# Altium schematic sheet CAN Communication.SchDoc
size A
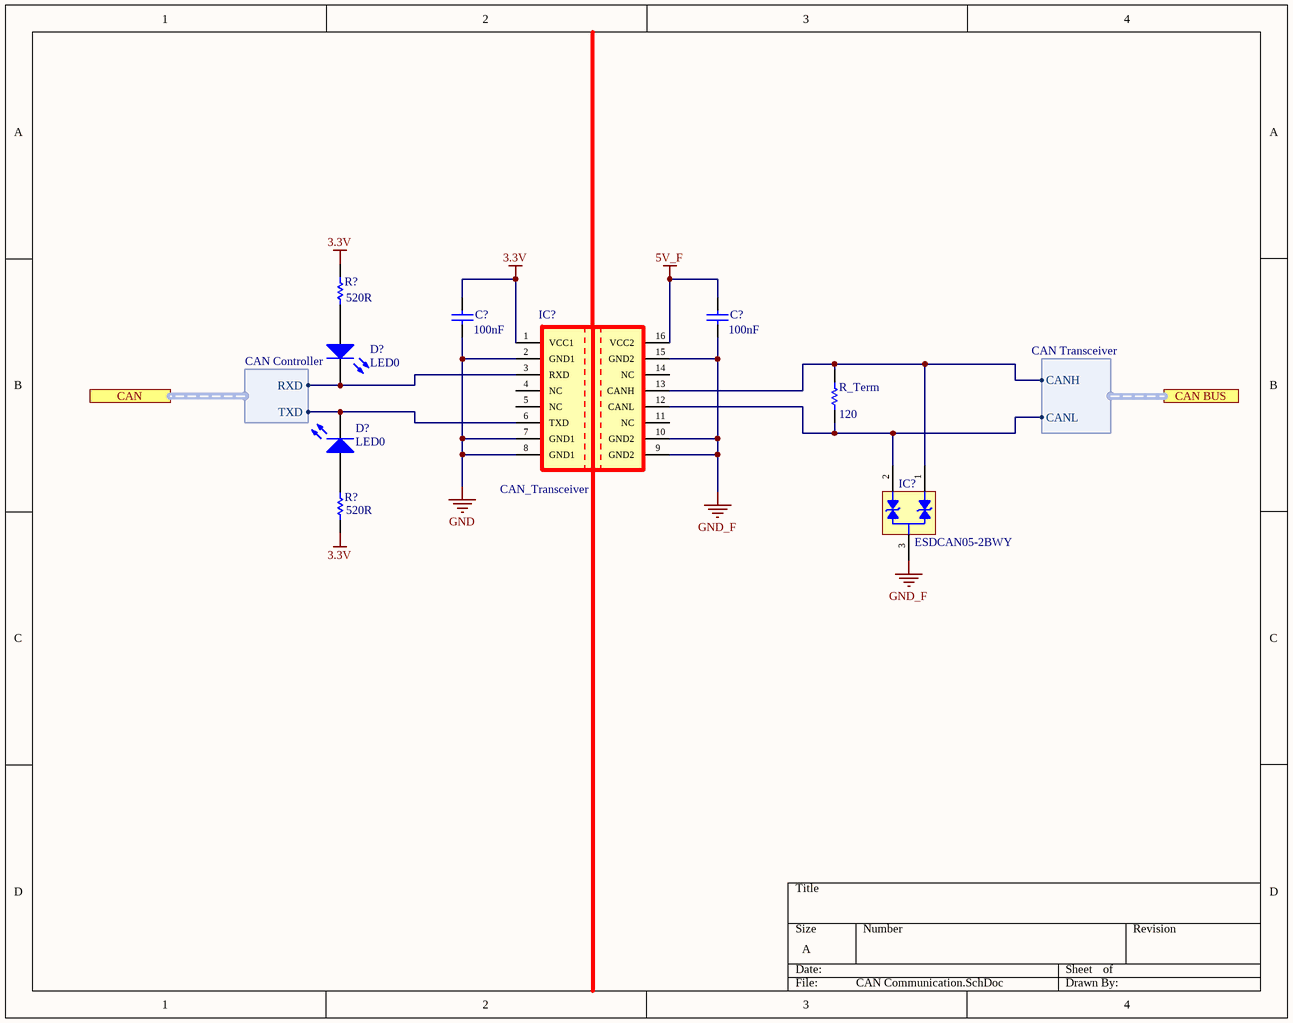
[diagram p0: CAN Communication.SchDoc]

## Parts
(Parts that share a designator on the sheet are numbered #1, #2 ... from top to bottom, then left to right.)
C?#1  value 100nF  [RAD-0.3]  (hidden comment: Cap)
C?#2  value 100nF  [RAD-0.3]  (hidden comment: Cap)
D?#1  LED0  [LED-0]
D?#2  LED0  [LED-0]
IC?#1  CAN_Transceiver  [SOIC127P1030X265-16N]
IC?#2  ESDCAN05-2BWY  [SOT70P210X110-3N]
R?#1  value 520R  [AXIAL-0.3]  (hidden comment: Res1)
R?#2  value 520R  [AXIAL-0.3]  (hidden comment: Res1)
R_Term  value 120  [AXIAL-0.3]  (hidden comment: Res1)

## Ports
CAN (harness CAN Controller), CAN BUS (harness CAN Transceiver)

## Harnesses
CAN Controller: TXD, RXD
CAN Transceiver: CANH, CANL

## Nets
3.3V: C?#1.2 IC?#1.1(VCC1) R?#1.2 R?#2.2
5V_F: C?#2.2 IC?#1.16(VCC2)
GND: C?#1.1 IC?#1.2(GND1) IC?#1.7(GND1) IC?#1.8(GND1)
GND_F: C?#2.1 IC?#1.9(GND2) IC?#1.10(GND2) IC?#1.15(GND2)
NetD?#1_1: D?#1.1(A) R?#1.1
NetD?#1_2: D?#1.2(K) IC?#1.3(RXD) ; port CAN.RXD
NetD?#2_1: D?#2.1(A) R?#2.1
NetD?#2_2: D?#2.2(K) IC?#1.6(TXD) ; port CAN.TXD
NetIC?#1_12: IC?#1.12(CANL) IC?#2.2 R_Term.1 ; port CAN BUS.CANL
NetIC?#1_13: IC?#1.13(CANH) IC?#2.1 R_Term.2 ; port CAN BUS.CANH

Not connected (* = marked no-connect by the designer): IC?#1 4(NC) 5(NC) 11(NC) 14(NC); IC?#2 3

## Notes on the sheet
- Labels drawn without touching a wire or pin: GND_F

## Library data of the parts
C?#1 C?#2 = Cap: Capacitor; Published: 8-Jun-2000; LatestRevisionDate: 17-Jul-2002; LatestRevisionNote: Re-released for DXP Platform.; PackageReference: RAD-0.3; Publisher: Altium Limited; PackageDescription: Radial Cap, Thru-Hole; 2 Leads; 0.3 in Pin Spacing
D?#1 D?#2 = LED0: Typical INFRARED GaAs LED; Published: 8-Jun-2000; LatestRevisionDate: 08-Jul-2005; LatestRevisionNote: Mech Layer 1 removed.; PackageReference: LED-0; Publisher: Altium Limited; PackageDescription: LED; 2 Leads
IC?#1 = ISO1050DWR: Digital Isolators Isolated 5V CAN Xcvr
IC?#2 = ESDCAN05-2BWY: Automotive dual-line TVS in SOT323-3L for CAN bus
R?#1 R?#2 R_Term = Res1: Resistor; Published: 8-Jun-2000; LatestRevisionDate: 17-Jul-2002; LatestRevisionNote: Re-released for DXP Platform.; PackageReference: AXIAL-0.3; Publisher: Altium Limited; PackageDescription: Axial Device, Thru-Hole; 2 Leads; 0.3 in Pin Spacing